# Altium project Competion.PrjPCB
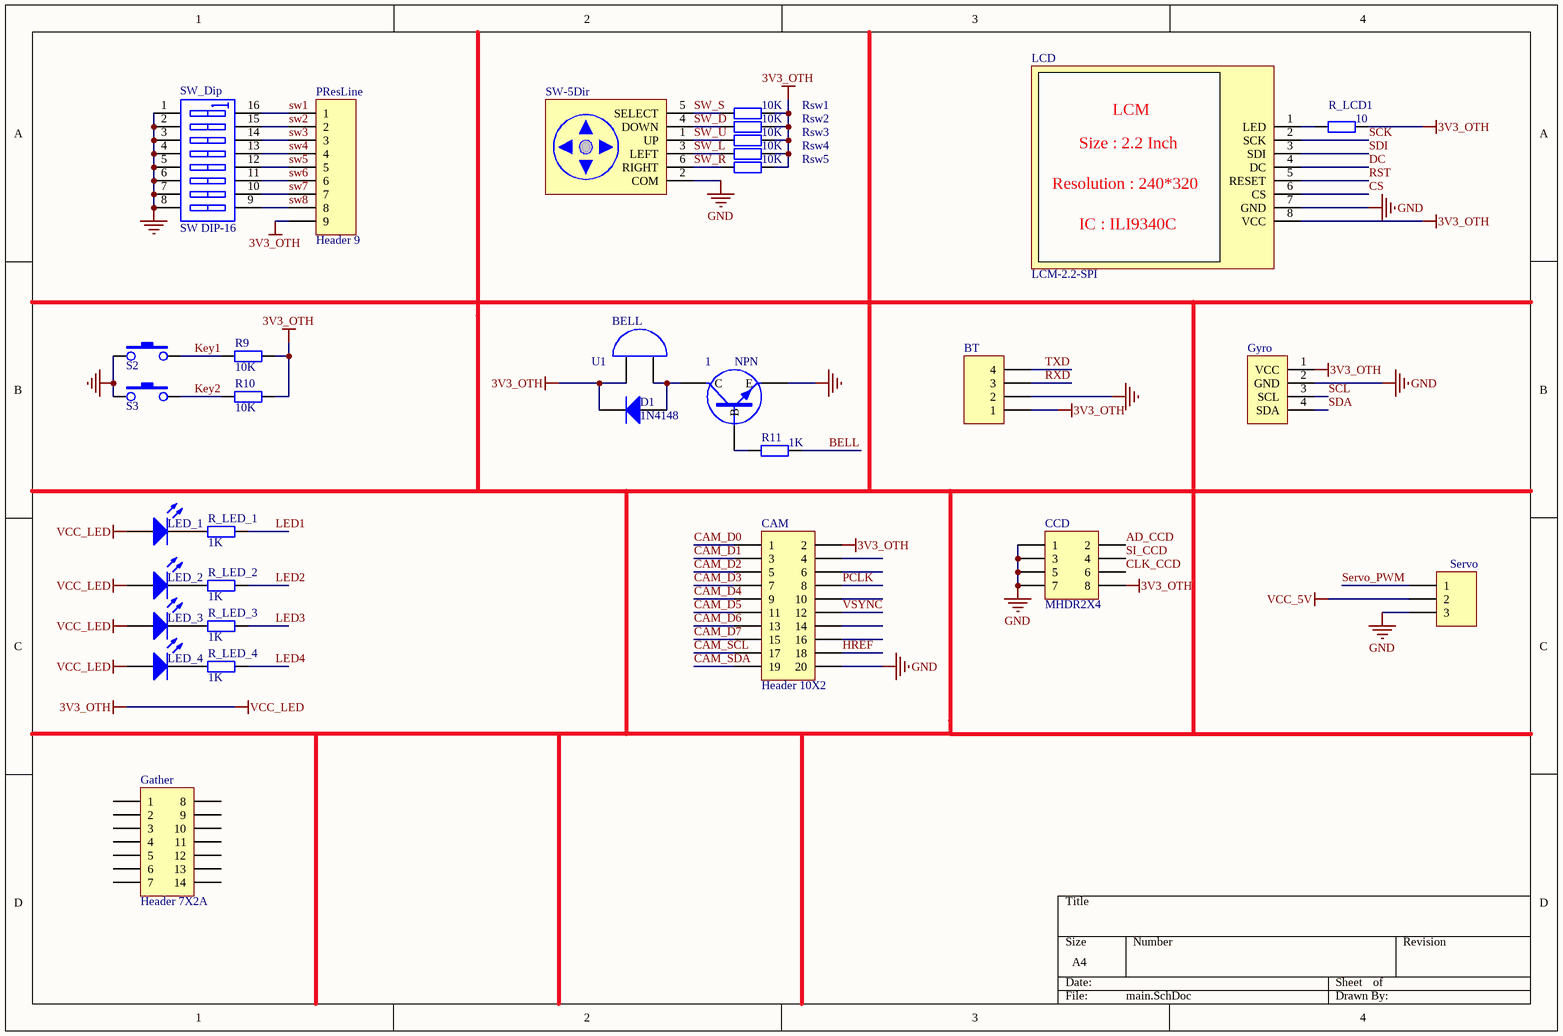
[diagram p0: main.SchDoc]
5 sheets, 81 parts. Net scope: global (net labels, ports and power ports of the same name join across sheets).
Board file: Competion.PcbDoc
Sheets:
  main.SchDoc
  K60_main.SchDoc
  Power.SchDoc
  Sensor.SchDoc
  export.SchDoc

## Sheet main.SchDoc
size A4

### Parts
1  NPN  [BEC_123_S]
BT  Header 4  [HDR1X4]  (value not drawn)
CAM  Header 10X2  [Camer]
CCD  MHDR2X4  [CCD]
D1  1N4148  [1N4148]
Gather  Header 7X2A  [HDR2X7_CEN]
Gyro  Gyro  [GYRO]  (value not drawn)
LCD  LCM-2.2-SPI  [LCD]
LED_1  LED  [0805-S]  (value not drawn)
LED_2  LED  [0805-S]  (value not drawn)
LED_3  LED  [0805-S]  (value not drawn)
LED_4  LED  [0805-S]  (value not drawn)
PResLine  Header 9  [HDR1X9]
R9  10K  [0805-S]
R10  10K  [0805-S]
R11  1K  [0805-S]
R_LCD1  10  [0805-S]
R_LED_1  1K  [0805-S]
R_LED_2  1K  [0805-S]
R_LED_3  1K  [0805-S]
R_LED_4  1K  [0805-S]
Rsw1  10K  [0805-S]
Rsw2  10K  [0805-S]
Rsw3  10K  [0805-S]
Rsw4  10K  [0805-S]
Rsw5  10K  [0805-S]
S2  SW-PB  [key-press]  (value not drawn)
S3  SW-PB  [key-press]  (value not drawn)
Servo  Ser_head  [HDR1X3]  (value not drawn)
SW-5Dir  SW-5dir  [SW-5dir]  (value not drawn)
SW_Dip  SW DIP-16  [DIP16]
U1  BELL  [BEEP]

### Nets
3V3_OTH: BT.1 CAM.2 CCD.8 D1.2(K) Gyro.1(VCC) LCD.8(VCC) LED_1.1(A) LED_2.1(A) LED_3.1(A) LED_4.1(A) PResLine.9 R9.1 R10.1 R_LCD1.1 Rsw1.2 Rsw2.2 Rsw3.2 Rsw4.2 Rsw5.2 U1.1(A)  [also labelled VCC_LED]
GND: 1.2(E) BT.2 CAM.20 CCD.1 CCD.3 CCD.5 CCD.7 Gyro.2(GND) LCD.7(GND) S2.1 S3.1 Servo.3 SW-5Dir.2(COM) SW_Dip.1(A1) SW_Dip.2(A2) SW_Dip.3(A3) SW_Dip.4(A4) SW_Dip.5(A5) SW_Dip.6(A6) SW_Dip.7(A7) SW_Dip.8(A8)
VCC_5V: Servo.2
AD_CCD: CCD.2
BELL: R11.2
CAM_D0: CAM.1
CAM_D1: CAM.3
CAM_D2: CAM.5
CAM_D3: CAM.7
CAM_D4: CAM.9
CAM_D5: CAM.11
CAM_D6: CAM.13
CAM_D7: CAM.15
CAM_SCL: CAM.17
CAM_SDA: CAM.19
CLK_CCD: CCD.6
CS: LCD.6(CS)
DC: LCD.4(DC)
HREF: CAM.18
Key1: R9.2 S2.2
Key2: R10.2 S3.2
LED1: R_LED_1.1
LED2: R_LED_2.1
LED3: R_LED_3.1
LED4: R_LED_4.1
PCLK: CAM.8
RST: LCD.5(RESET)  [project net PE7]
RXD: BT.3  [project net PD6]
SCK: LCD.2(SCK)  [project net PE10]
SCL: Gyro.3(SCL)  [project net PC19]
SDA: Gyro.4(SDA)  [project net PD0]
SDI: LCD.3(SDI)  [project net PE9]
Servo_PWM: Servo.1  [project net PA8]
SI_CCD: CCD.4  [project net PB1]
sw1: PResLine.1 SW_Dip.16(B1)  [project net PC6]
sw2: PResLine.2 SW_Dip.15(B2)  [project net PC7]
sw3: PResLine.3 SW_Dip.14(B3)  [project net PC8]
sw4: PResLine.4 SW_Dip.13(B4)  [project net PC9]
sw5: PResLine.5 SW_Dip.12(B5)  [project net PC10]
sw6: PResLine.6 SW_Dip.11(B6)  [project net PC11]
sw7: PResLine.7 SW_Dip.10(B7)  [project net PC12]
sw8: PResLine.8 SW_Dip.9(B8)  [project net PC13]
SW_D: Rsw2.1 SW-5Dir.4(DOWN)  [project net PB6]
SW_L: Rsw4.1 SW-5Dir.3(LEFT)  [project net PB10]
SW_R: Rsw5.1 SW-5Dir.6(RIGHT)  [project net PB7]
SW_S: Rsw1.1 SW-5Dir.5(SELECT)  [project net PB8]
SW_U: Rsw3.1 SW-5Dir.1(UP)  [project net PB9]
TXD: BT.4  [project net PD7]
VSYNC: CAM.12  [project net PD14]
Net1_1: 1.1(B) R11.1
Net1_3: 1.3(C) D1.1(A) U1.2(B)
NetLCD_1: LCD.1(LED) R_LCD1.2
NetLED_1_2: LED_1.2(K) R_LED_1.2
NetLED_2_2: LED_2.2(K) R_LED_2.2
NetLED_3_2: LED_3.2(K) R_LED_3.2
NetLED_4_2: LED_4.2(K) R_LED_4.2

Not connected (* = marked no-connect by the designer): CAM 4 6 10 14 16; Gather 1 2 3 4 5 6 7 8 9 10 11 12 13 14

### Notes on the sheet
- (in symbol LCM-2.2-SPI) LCM; Size : 2.2 Inch; Resolution : 240*320; IC : ILI9340C

### Library data of the parts
BT = Header 4: Header, 4-Pin; LatestRevisionDate: 17-Jul-2002; LatestRevisionNote: Re-released for DXP Platform.; Publisher: Altium Limited
CAM = Header 10X2: Header, 10-Pin, Dual row; LatestRevisionDate: 17-Jul-2002; LatestRevisionNote: Re-released for DXP Platform.; Publisher: Altium Limited
CCD = MHDR2X4: Header, 4-Pin, Dual row; LatestRevisionDate: 17-Jul-2002; LatestRevisionNote: Re-released for DXP Platform.; Publisher: Altium Limited
D1 = Diode: Published: 8-Jun-2000; LatestRevisionDate: 17-Jul-2002; LatestRevisionNote: Re-released for DXP Platform.; PackageDocument: Sep-1996; Publisher: Altium Limited; Code_JEDEC: DO-214-AB
Gather = Header 7X2A: Header, 7-Pin, Dual row; LatestRevisionDate: 17-Jul-2002; LatestRevisionNote: Re-released for DXP Platform.; Publisher: Altium Limited
LCD = LCM-2.2-SPI: LCM 2.2inch SPI; LatestRevisionDate: 17-Jul-2002; LatestRevisionNote: Re-released for DXP Platform.; Publisher: Altium Limited
LED_1-LED_4 = LED0: Typical INFRARED GaAs LED; Published: 8-Jun-2000; LatestRevisionDate: 08-Jul-2005; LatestRevisionNote: Mech Layer 1 removed.; PackageReference: LED-0; Publisher: Altium Limited
PResLine = Header 9: Header, 9-Pin; LatestRevisionDate: 17-Jul-2002; LatestRevisionNote: Re-released for DXP Platform.; Publisher: Altium Limited
R9 R10 R_LCD1 = Res2: Resistor; Value: 3.32K; Published: 8-Jun-2000; LatestRevisionDate: 17-Jul-2002; LatestRevisionNote: Re-released for DXP Platform.; PackageReference: AXIAL-0.4; Publisher: Altium Limited; PackageDescription: Axial Device, Thru-Hole; 2 Leads; 0.4 in Pin Spacing
R11 R_LED_1-R_LED_4 = Res2: Resistor; Published: 8-Jun-2000; LatestRevisionDate: 17-Jul-2002; LatestRevisionNote: Re-released for DXP Platform.; PackageReference: AXIAL-0.4; Publisher: Altium Limited; Value: 1K
Rsw1-Rsw5 = Res2: Resistor; Value: 1K; Published: 8-Jun-2000; LatestRevisionDate: 17-Jul-2002; LatestRevisionNote: Re-released for DXP Platform.; PackageReference: AXIAL-0.4; Publisher: Altium Limited
Servo = Header 3: Header, 3-Pin; LatestRevisionDate: 17-Jul-2002; LatestRevisionNote: Re-released for DXP Platform.; Publisher: Altium Limited
SW-5Dir = SW-5dir: 2pin_GND; LatestRevisionDate: 17-Jul-2002; LatestRevisionNote: Re-released for DXP Platform.; Publisher: Altium Limited
SW_Dip = SW DIP-8: DIP Switch, 8 Position, SPST; Published: 24-Mar-1999; LatestRevisionDate: 17-Jul-2002; LatestRevisionNote: Re-released for DXP Platform.; PackageReference: DIP_SW_8WAY_SMD; Publisher: Altium Limited

## Sheet K60_main.SchDoc
size A4
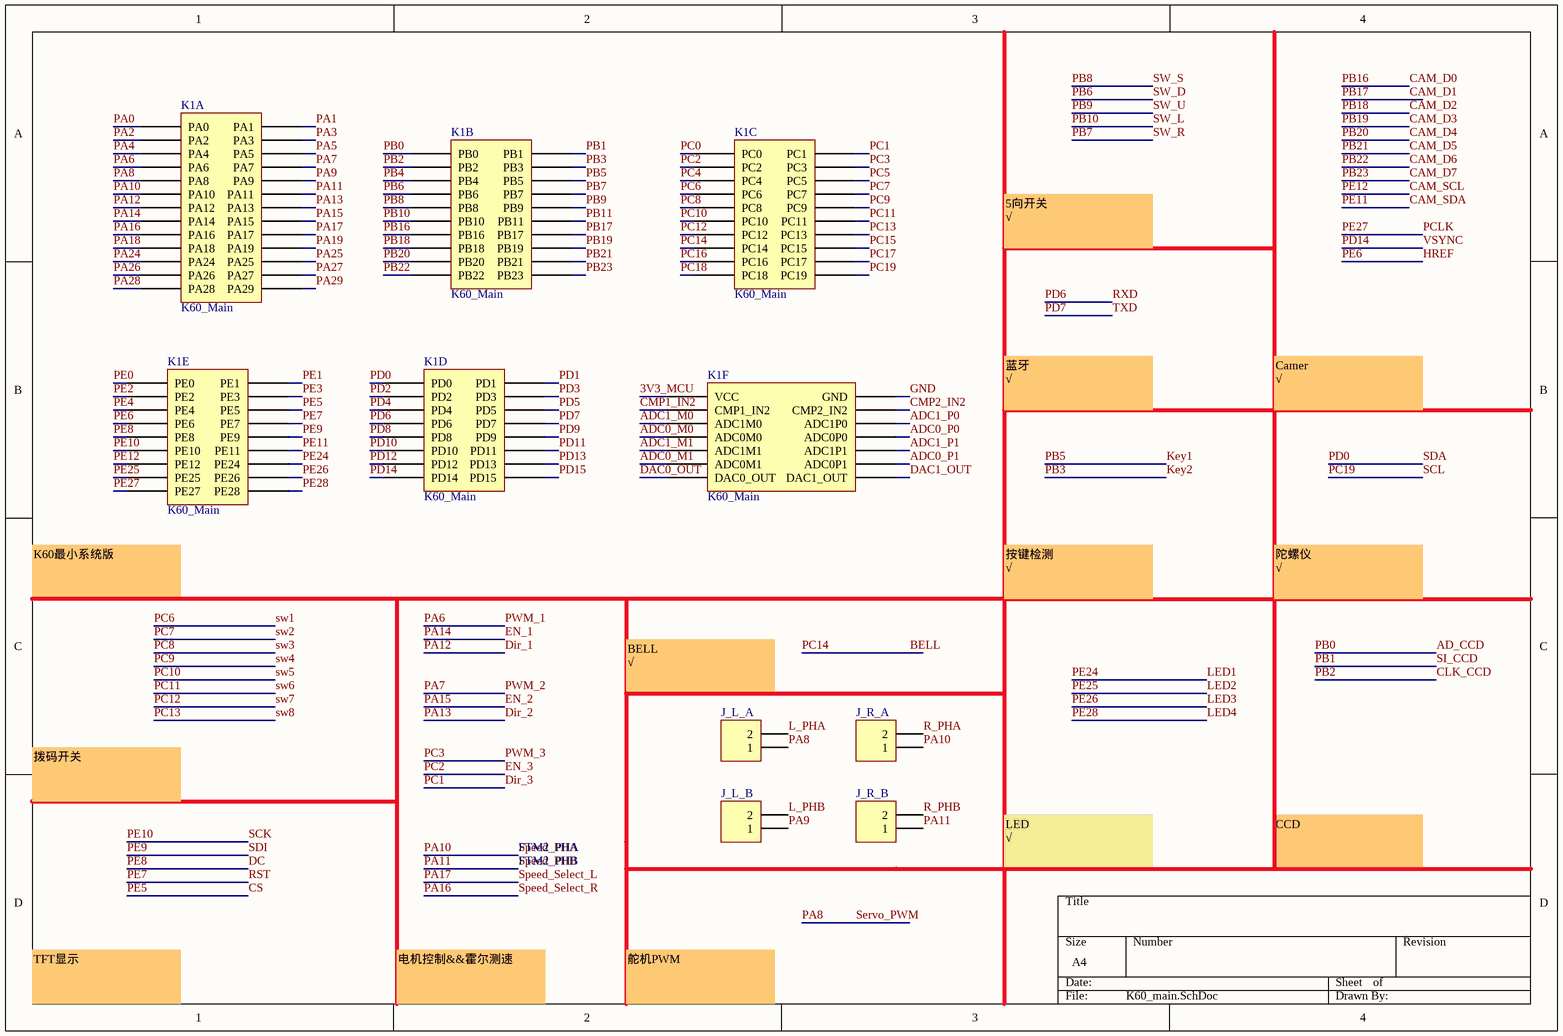
[diagram p1: K60_main.SchDoc]

### Parts
J_L_A  Header 2  [HDR1X2]  (value not drawn)
J_L_B  Header 2  [HDR1X2]  (value not drawn)
J_R_A  Header 2  [HDR1X2]  (value not drawn)
J_R_B  Header 2  [HDR1X2]  (value not drawn)
K1  K60_Main  [K60_Main_Board]  (parts A,B,C,D,E,F of 6)

### Nets
3V3_MCU: K1.11(VCC)
GND: K1.12(GND)
AD_CCD: K1.49(PB0)  [also labelled PB0]
ADC0_M0: K1.23(ADC0M0)
ADC0_M1: K1.27(ADC0M1)
ADC0_P0: K1.24(ADC0P0)
ADC0_P1: K1.28(ADC0P1)
ADC1_M0: K1.21(ADC1M0)
ADC1_M1: K1.25(ADC1M1)
ADC1_P0: K1.22(ADC1P0)
ADC1_P1: K1.26(ADC1P1)
BELL: K1.35(PC14)  [also labelled PC14]
CAM_D0: K1.327(PB16)  [also labelled PB16]
CAM_D1: K1.326(PB17)  [also labelled PB17]
CAM_D2: K1.325(PB18)  [also labelled PB18]
CAM_D3: K1.324(PB19)  [also labelled PB19]
CAM_D4: K1.323(PB20)  [also labelled PB20]
CAM_D5: K1.322(PB21)  [also labelled PB21]
CAM_D6: K1.321(PB22)  [also labelled PB22]
CAM_D7: K1.320(PB23)  [also labelled PB23]
CAM_SCL: K1.29(PE12)  [also labelled PE12]
CAM_SDA: K1.210(PE11)  [also labelled PE11]
CLK_CCD: K1.47(PB2)  [also labelled PB2]
CMP1_IN2: K1.13(CMP1_IN2)
CMP2_IN2: K1.14(CMP2_IN2)
CS: K1.216(PE5)  [also labelled PE5]
DAC0_OUT: K1.54(DAC0_OUT)
DAC1_OUT: K1.53(DAC1_OUT)
DC: K1.213(PE8)  [also labelled PE8]
Dir_1: K1.423(PA12)  [also labelled PA12]
Dir_2: K1.422(PA13)  [also labelled PA13]
Dir_3: K1.318(PC1)  [also labelled PC1]
EN_1: K1.421(PA14)  [also labelled PA14]
EN_2: K1.420(PA15)  [also labelled PA15]
EN_3: K1.317(PC2)  [also labelled PC2]
HREF: K1.215(PE6)  [also labelled PE6]
Key1: K1.44(PB5)  [also labelled PB5]
Key2: K1.46(PB3)  [also labelled PB3]
L_PHA: J_L_A.2
L_PHB: J_L_B.2
LED1: K1.52(PE24)  [also labelled PE24]
LED2: K1.51(PE25)  [also labelled PE25]
LED3: K1.438(PE26)  [also labelled PE26]
LED4: K1.436(PE28)  [also labelled PE28]
PA0: K1.435(PA0)
PA1: K1.434(PA1)
PA2: K1.433(PA2)
PA3: K1.432(PA3)
PA4: K1.431(PA4)
PA5: K1.430(PA5)
PA6: K1.429(PA6)  [also labelled PWM_1]
PA7: K1.428(PA7)  [also labelled PWM_2]
PA8: J_L_A.1 K1.427(PA8)  [also labelled Servo_PWM]
PA9: J_L_B.1 K1.426(PA9)
PA10: J_R_A.1 K1.425(PA10)  [also labelled Speed_PHA]
PA11: J_R_B.1 K1.424(PA11)  [also labelled Speed_PHB]
PA16: K1.419(PA16)  [also labelled Speed_Select_R]
PA17: K1.418(PA17)  [also labelled Speed_Select_L]
PA18: K1.417(PA18)
PA19: K1.416(PA19)
PA24: K1.415(PA24)
PA25: K1.414(PA25)
PA26: K1.413(PA26)
PA27: K1.412(PA27)
PA28: K1.411(PA28)
PA29: K1.410(PA29)
PB1: K1.48(PB1)  [also labelled SI_CCD]
PB4: K1.45(PB4)
PB6: K1.43(PB6)  [also labelled SW_D]
PB7: K1.42(PB7)  [also labelled SW_R]
PB8: K1.41(PB8)  [also labelled SW_S]
PB9: K1.330(PB9)  [also labelled SW_U]
PB10: K1.329(PB10)  [also labelled SW_L]
PB11: K1.328(PB11)
PC0: K1.319(PC0)
PC3: K1.316(PC3)  [also labelled PWM_3]
PC4: K1.315(PC4)
PC5: K1.314(PC5)
PC6: K1.313(PC6)  [also labelled sw1]
PC7: K1.312(PC7)  [also labelled sw2]
PC8: K1.311(PC8)  [also labelled sw3]
PC9: K1.310(PC9)  [also labelled sw4]
PC10: K1.39(PC10)  [also labelled sw5]
PC11: K1.38(PC11)  [also labelled sw6]
PC12: K1.37(PC12)  [also labelled sw7]
PC13: K1.36(PC13)  [also labelled sw8]
PC15: K1.34(PC15)
PC16: K1.33(PC16)
PC17: K1.32(PC17)
PC18: K1.31(PC18)
PC19: K1.238(PC19)  [also labelled SCL]
PCLK: K1.437(PE27)  [also labelled PE27]
PD0: K1.237(PD0)  [also labelled SDA]
PD1: K1.236(PD1)
PD2: K1.235(PD2)
PD3: K1.234(PD3)
PD4: K1.233(PD4)
PD5: K1.232(PD5)
PD6: K1.231(PD6)  [also labelled RXD]
PD7: K1.230(PD7)  [also labelled TXD]
PD8: K1.229(PD8)
PD9: K1.228(PD9)
PD10: K1.227(PD10)
PD11: K1.226(PD11)
PD12: K1.225(PD12)
PD13: K1.224(PD13)
PD14: K1.223(PD14)  [also labelled VSYNC]
PD15: K1.222(PD15)
PE0: K1.221(PE0)
PE1: K1.220(PE1)
PE2: K1.219(PE2)
PE3: K1.218(PE3)
PE4: K1.217(PE4)
PE7: K1.214(PE7)  [also labelled RST]
PE9: K1.212(PE9)  [also labelled SDI]
PE10: K1.211(PE10)  [also labelled SCK]
R_PHA: J_R_A.2
R_PHB: J_R_B.2

### Notes on the sheet
- 5向开关
  √
- 蓝牙
  √
- Camer
  √
- K60最小系统版
- 按键检测
  √
- 陀螺仪
  √
- (near J_L_A) BELL
  √
- 拨码开关
- FTM2_PHA
- FTM2_PHB
- LED
  √
- CCD
- TFT显示
- 电机控制&&霍尔测速
- 舵机PWM

### Library data of the parts
J_L_A J_L_B J_R_A J_R_B = Header 2: Header, 2-Pin; LatestRevisionDate: 17-Jul-2002; LatestRevisionNote: Re-released for DXP Platform.; Publisher: Altium Limited

## Sheet Power.SchDoc
size A4
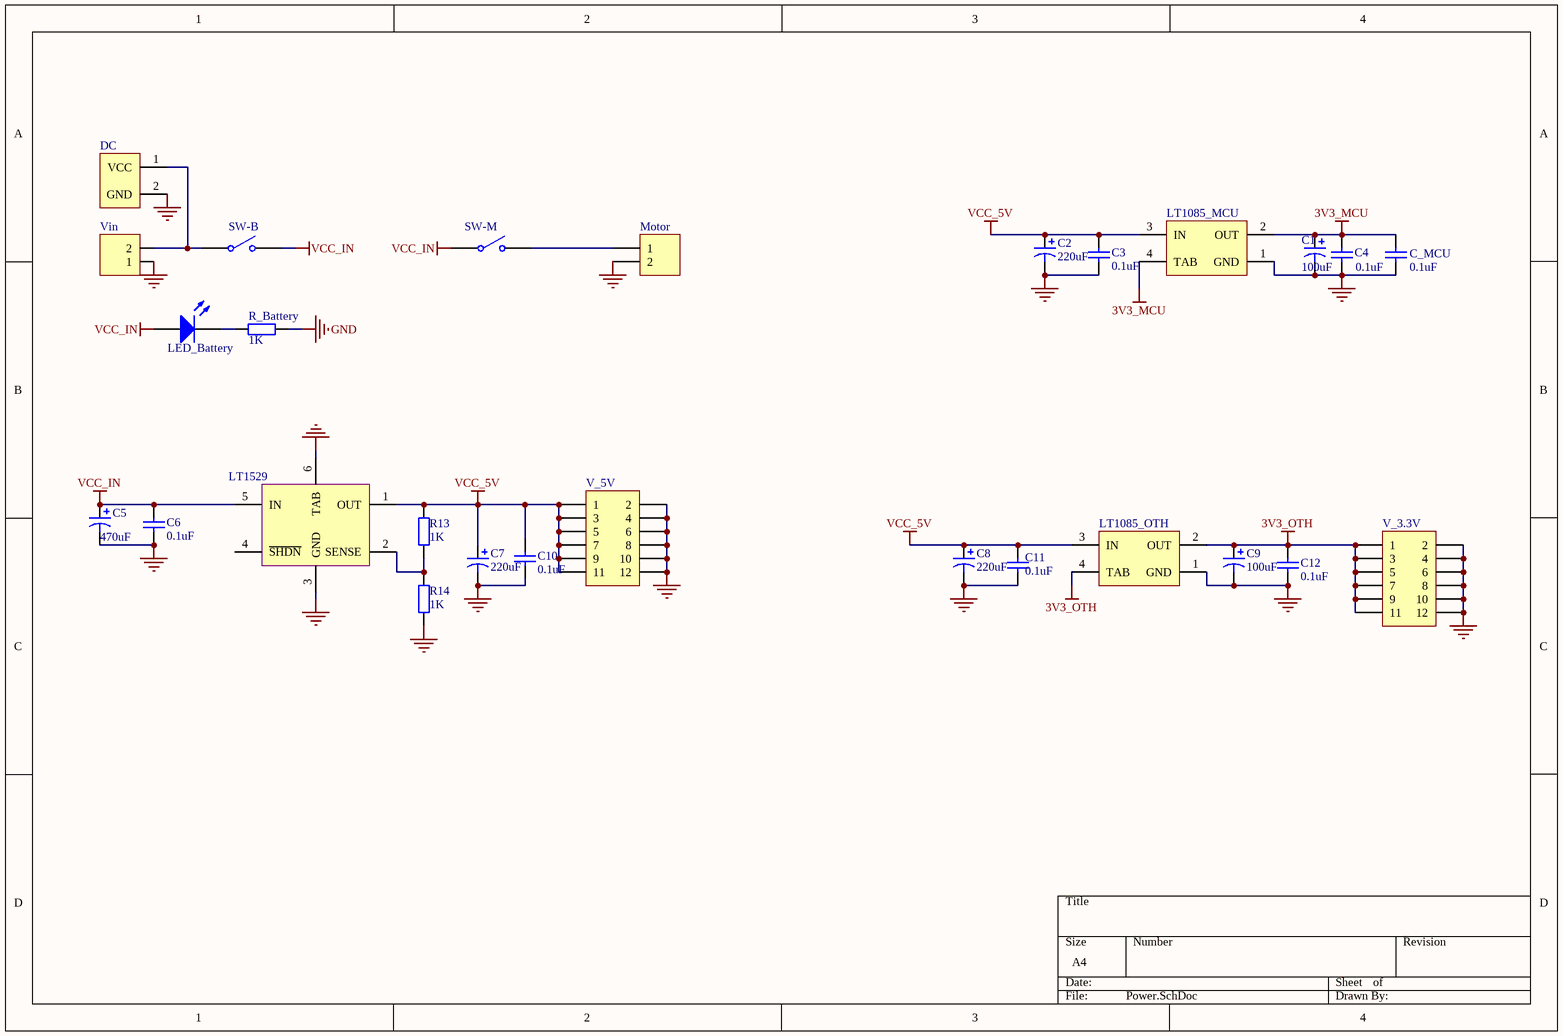
[diagram p2: Power.SchDoc]

### Parts
C1  100uf  [100uf-25V]
C2  220uf  [220UF-25V]
C3  0.1uf  [0805-S]
C4  0.1uf  [0805-S]
C5  470uf  [220UF-25V]
C6  0.1uF  [0805-S]
C7  220uf  [220UF-25V]
C8  220uf  [220UF-25V]
C9  100uf  [100uf-25V]
C10  0.1uF  [0805-S]
C11  0.1uf  [0805-S]
C12  0.1uf  [0805-S]
C_MCU  0.1uf  [0805-S]
DC  DC0005  [DC]  (value not drawn)
LED_Battery  LED  [0805-S]  (value not drawn)
LT1085_MCU  LT1085-3.3  [TS3B_N]  (value not drawn)
LT1085_OTH  LT1085-3.3  [TS3B_N]  (value not drawn)
LT1529  LT1529  [TS5B]  (value not drawn)
Motor  Header 2  [Head2_small]  (value not drawn)
R13  1K  [0805-S]
R14  1K  [0805-S]
R_Battery  1K  [0805-S]
SW-B  SW-TOGGLE  [SW-TOGGLE]  (value not drawn)
SW-M  SW-TOGGLE  [SW-TOGGLE]  (value not drawn)
V_3.3V  Header 6X2  [HDR2X6]  (value not drawn)
V_5V  Header 6X2  [HDR2X6]  (value not drawn)
Vin  Header 2  [Head2_small]  (value not drawn)

### Nets
3V3_MCU: C1.1 C4.2 C_MCU.2 LT1085_MCU.2(OUT) LT1085_MCU.4(TAB)
3V3_OTH: C9.1 C12.2 LT1085_OTH.2(OUT) LT1085_OTH.4(TAB) V_3.3V.1 V_3.3V.3 V_3.3V.5 V_3.3V.7 V_3.3V.9 V_3.3V.11
GND: C1.2 C2.2 C3.1 C4.1 C5.2 C6.1 C7.2 C8.2 C9.2 C10.1 C11.1 C12.1 C_MCU.1 DC.2(GND) LT1085_MCU.1(GND) LT1085_OTH.1(GND) LT1529.3(GND) LT1529.6(TAB) Motor.2 R14.1 R_Battery.1 V_3.3V.2 V_3.3V.4 V_3.3V.6 V_3.3V.8 V_3.3V.10 V_3.3V.12 V_5V.2 V_5V.4 V_5V.6 V_5V.8 V_5V.10 V_5V.12 Vin.1
VCC_5V: C2.1 C3.2 C7.1 C8.1 C10.2 C11.2 LT1085_MCU.3(IN) LT1085_OTH.3(IN) LT1529.1(OUT) R13.2 V_5V.1 V_5V.3 V_5V.5 V_5V.7 V_5V.9 V_5V.11
VCC_IN: C5.1 C6.2 LED_Battery.1(A) LT1529.5(IN) SW-B.2(NO) SW-M.1(COMMON)
NetDC_1: DC.1(VCC) SW-B.1(COMMON) Vin.2
NetLED_Battery_2: LED_Battery.2(K) R_Battery.2
NetLT1529_2: LT1529.2(SENSE) R13.1 R14.2
NetMotor_1: Motor.1 SW-M.2(NO)

Not connected (* = marked no-connect by the designer): LT1529 4(~{SHDN})

### Library data of the parts
C1 C2 C5 C7-C9 = Cap Pol1: Polarized Capacitor (Radial); Published: 8-Jun-2000; LatestRevisionDate: 17-Jul-2002; LatestRevisionNote: Re-released for DXP Platform.; PackageReference: RB7.6-15; Publisher: Altium Limited; PackageDescription: Polarized Capacitor (Radial); 2 Leads
  C1 C9: Value: 100uF
  C2 C7 C8: Value: 220uF
  C5: Value: 470uF
C3 C4 C11 C12 C_MCU = Cap: Capacitor; Published: 8-Jun-2000; LatestRevisionDate: 17-Jul-2002; LatestRevisionNote: Re-released for DXP Platform.; PackageReference: RAD-0.3; Publisher: Altium Limited; PackageDescription: Radial Cap, Thru-Hole; 2 Leads; 0.3 in Pin Spacing; Value: 0.1uF
C6 C10 = Cap_1: Capacitor; Published: 8-Jun-2000; LatestRevisionDate: 17-Jul-2002; LatestRevisionNote: Re-released for DXP Platform.; PackageReference: RAD-0.3; Publisher: Altium Limited; Value: 0.1uF
LED_Battery = LED0: Typical INFRARED GaAs LED; Published: 8-Jun-2000; LatestRevisionDate: 08-Jul-2005; LatestRevisionNote: Mech Layer 1 removed.; PackageReference: LED-0; Publisher: Altium Limited
Motor Vin = Header 2: Header, 2-Pin; LatestRevisionDate: 17-Jul-2002; LatestRevisionNote: Re-released for DXP Platform.; Publisher: Altium Limited
R13 R14 = Res2_3: Resistor; Published: 8-Jun-2000; LatestRevisionDate: 17-Jul-2002; LatestRevisionNote: Re-released for DXP Platform.; PackageReference: AXIAL-0.4; Publisher: Altium Limited; Value: 1K
R_Battery = Res2: Resistor; Published: 8-Jun-2000; LatestRevisionDate: 17-Jul-2002; LatestRevisionNote: Re-released for DXP Platform.; PackageReference: AXIAL-0.4; Publisher: Altium Limited; Value: 1K
SW-B SW-M = SW-TOGGLE: Single-Pole, Single-Throw Switch; Published: 24-Mar-1999; LatestRevisionDate: 17-Jul-2002; LatestRevisionNote: Re-released for DXP Platform.; PackageReference: SPST-2; Publisher: Altium Limited
V_3.3V V_5V = Header 6X2: Header, 6-Pin, Dual row; LatestRevisionDate: 17-Jul-2002; LatestRevisionNote: Re-released for DXP Platform.; Publisher: Altium Limited

## Sheet Sensor.SchDoc
size A4
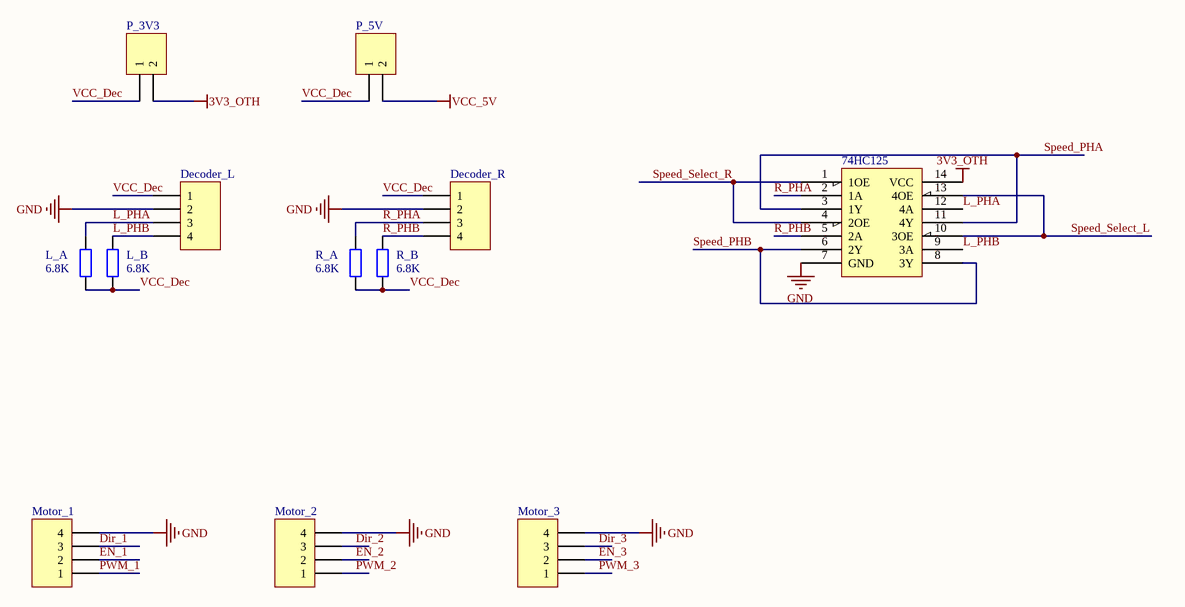
[diagram p3: Sensor.SchDoc]

### Parts
74HC125  74HC125  [751A-02_N]  (value not drawn)
Decoder_L  Header 4  [HDR1X4]  (value not drawn)
Decoder_R  Header 4  [HDR1X4]  (value not drawn)
L_A  6.8K  [0805-S]
L_B  6.8K  [0805-S]
Motor_1  Header 4  [HDR1X4]  (value not drawn)
Motor_2  Header 4  [HDR1X4]  (value not drawn)
Motor_3  Header 4  [HDR1X4]  (value not drawn)
P_3V3  Header 2  [HDR1X2]  (value not drawn)
P_5V  Header 2  [HDR1X2]  (value not drawn)
R_A  6.8K  [0805-S]
R_B  6.8K  [0805-S]

### Nets
3V3_OTH: 74HC125.14(VCC) P_3V3.2
GND: 74HC125.7(GND) Decoder_L.2 Decoder_R.2 Motor_1.4 Motor_2.4 Motor_3.4
VCC_5V: P_5V.2
Dir_1: Motor_1.3
Dir_2: Motor_2.3
Dir_3: Motor_3.3
EN_1: Motor_1.2
EN_2: Motor_2.2
EN_3: Motor_3.2
L_PHA: 74HC125.12(4A) Decoder_L.3 L_A.2
L_PHB: 74HC125.9(3A) Decoder_L.4 L_B.2
PWM_1: Motor_1.1  [project net PA6]
PWM_2: Motor_2.1  [project net PA7]
PWM_3: Motor_3.1  [project net PC3]
R_PHA: 74HC125.2(1A) Decoder_R.3 R_A.2
R_PHB: 74HC125.5(2A) Decoder_R.4 R_B.2
Speed_PHA: 74HC125.3(1Y) 74HC125.11(4Y)  [project net PA10]
Speed_PHB: 74HC125.6(2Y) 74HC125.8(3Y)  [project net PA11]
Speed_Select_L: 74HC125.10(3OE) 74HC125.13(4OE)  [project net PA17]
Speed_Select_R: 74HC125.1(1OE) 74HC125.4(2OE)  [project net PA16]
VCC_Dec: Decoder_L.1 Decoder_R.1 L_A.1 L_B.1 P_3V3.1 P_5V.1 R_A.1 R_B.1

### Library data of the parts
Decoder_L Decoder_R Motor_1-Motor_3 = Header 4: Header, 4-Pin; LatestRevisionDate: 17-Jul-2002; LatestRevisionNote: Re-released for DXP Platform.; Publisher: Altium Limited
L_A L_B R_A R_B = Res2_3: Resistor; Published: 8-Jun-2000; LatestRevisionDate: 17-Jul-2002; LatestRevisionNote: Re-released for DXP Platform.; PackageReference: AXIAL-0.4; Publisher: Altium Limited; Value: 6.8K
P_3V3 P_5V = Header 2: Header, 2-Pin; LatestRevisionDate: 17-Jul-2002; LatestRevisionNote: Re-released for DXP Platform.; Publisher: Altium Limited

## Sheet export.SchDoc
size A4
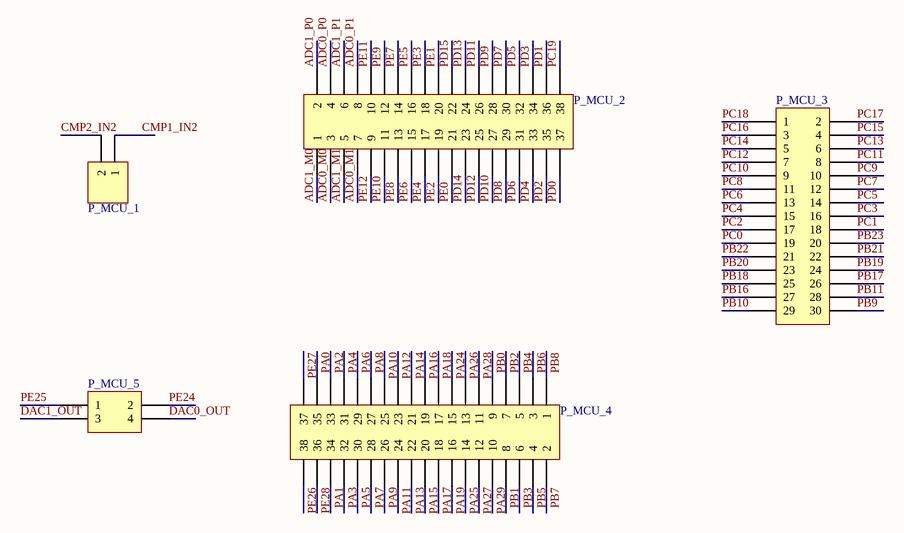
[diagram p4: export.SchDoc]

### Parts
P_MCU_1  Header 2  [HDR1X2]  (value not drawn)
P_MCU_2  Header 19X2  [HDR2X19]  (value not drawn)
P_MCU_3  Header 15X2  [HDR2X15]  (value not drawn)
P_MCU_4  Header 19X2  [HDR2X19]  (value not drawn)
P_MCU_5  Header 2X2  [HDR2X2]  (value not drawn)

### Nets
ADC0_M0: P_MCU_2.3
ADC0_M1: P_MCU_2.7
ADC0_P0: P_MCU_2.4
ADC0_P1: P_MCU_2.8
ADC1_M0: P_MCU_2.1
ADC1_M1: P_MCU_2.5
ADC1_P0: P_MCU_2.2
ADC1_P1: P_MCU_2.6
CMP1_IN2: P_MCU_1.1
CMP2_IN2: P_MCU_1.2
DAC0_OUT: P_MCU_5.4
DAC1_OUT: P_MCU_5.3
PA0: P_MCU_4.35
PA1: P_MCU_4.34
PA2: P_MCU_4.33
PA3: P_MCU_4.32
PA4: P_MCU_4.31
PA5: P_MCU_4.30
PA6: P_MCU_4.29
PA7: P_MCU_4.28
PA8: P_MCU_4.27
PA9: P_MCU_4.26
PA10: P_MCU_4.25
PA11: P_MCU_4.24
PA12: P_MCU_4.23  [project net Dir_1]
PA13: P_MCU_4.22  [project net Dir_2]
PA14: P_MCU_4.21  [project net EN_1]
PA15: P_MCU_4.20  [project net EN_2]
PA16: P_MCU_4.19
PA17: P_MCU_4.18
PA18: P_MCU_4.17
PA19: P_MCU_4.16
PA24: P_MCU_4.15
PA25: P_MCU_4.14
PA26: P_MCU_4.13
PA27: P_MCU_4.12
PA28: P_MCU_4.11
PA29: P_MCU_4.10
PB0: P_MCU_4.9  [project net AD_CCD]
PB1: P_MCU_4.8
PB2: P_MCU_4.7  [project net CLK_CCD]
PB3: P_MCU_4.6  [project net Key2]
PB4: P_MCU_4.5
PB5: P_MCU_4.4  [project net Key1]
PB6: P_MCU_4.3
PB7: P_MCU_4.2
PB8: P_MCU_4.1
PB9: P_MCU_3.30
PB10: P_MCU_3.29
PB11: P_MCU_3.28
PB16: P_MCU_3.27  [project net CAM_D0]
PB17: P_MCU_3.26  [project net CAM_D1]
PB18: P_MCU_3.25  [project net CAM_D2]
PB19: P_MCU_3.24  [project net CAM_D3]
PB20: P_MCU_3.23  [project net CAM_D4]
PB21: P_MCU_3.22  [project net CAM_D5]
PB22: P_MCU_3.21  [project net CAM_D6]
PB23: P_MCU_3.20  [project net CAM_D7]
PC0: P_MCU_3.19
PC1: P_MCU_3.18  [project net Dir_3]
PC2: P_MCU_3.17  [project net EN_3]
PC3: P_MCU_3.16
PC4: P_MCU_3.15
PC5: P_MCU_3.14
PC6: P_MCU_3.13
PC7: P_MCU_3.12
PC8: P_MCU_3.11
PC9: P_MCU_3.10
PC10: P_MCU_3.9
PC11: P_MCU_3.8
PC12: P_MCU_3.7
PC13: P_MCU_3.6
PC14: P_MCU_3.5  [project net BELL]
PC15: P_MCU_3.4
PC16: P_MCU_3.3
PC17: P_MCU_3.2
PC18: P_MCU_3.1
PC19: P_MCU_2.38
PD0: P_MCU_2.37
PD1: P_MCU_2.36
PD2: P_MCU_2.35
PD3: P_MCU_2.34
PD4: P_MCU_2.33
PD5: P_MCU_2.32
PD6: P_MCU_2.31
PD7: P_MCU_2.30
PD8: P_MCU_2.29
PD9: P_MCU_2.28
PD10: P_MCU_2.27
PD11: P_MCU_2.26
PD12: P_MCU_2.25
PD13: P_MCU_2.24
PD14: P_MCU_2.23
PD15: P_MCU_2.22
PE0: P_MCU_2.21
PE1: P_MCU_2.20
PE2: P_MCU_2.19
PE3: P_MCU_2.18
PE4: P_MCU_2.17
PE5: P_MCU_2.16  [project net CS]
PE6: P_MCU_2.15  [project net HREF]
PE7: P_MCU_2.14
PE8: P_MCU_2.13  [project net DC]
PE9: P_MCU_2.12
PE10: P_MCU_2.11
PE11: P_MCU_2.10  [project net CAM_SDA]
PE12: P_MCU_2.9  [project net CAM_SCL]
PE24: P_MCU_5.2  [project net LED1]
PE25: P_MCU_5.1  [project net LED2]
PE26: P_MCU_4.38  [project net LED3]
PE27: P_MCU_4.37  [project net PCLK]
PE28: P_MCU_4.36  [project net LED4]

### Library data of the parts
P_MCU_1 = Header 2: Header, 2-Pin; LatestRevisionDate: 17-Jul-2002; LatestRevisionNote: Re-released for DXP Platform.; Publisher: Altium Limited
P_MCU_2 P_MCU_4 = Header 19X2: Header, 19-Pin, Dual row; LatestRevisionDate: 17-Jul-2002; LatestRevisionNote: Re-released for DXP Platform.; Publisher: Altium Limited
P_MCU_3 = Header 15X2: Header, 15-Pin, Dual row; LatestRevisionDate: 17-Jul-2002; LatestRevisionNote: Re-released for DXP Platform.; Publisher: Altium Limited
P_MCU_5 = Header 2X2: Header, 2-Pin, Dual row; LatestRevisionDate: 17-Jul-2002; LatestRevisionNote: Re-released for DXP Platform.; Publisher: Altium Limited

## Nets that join several sheets
3V3_MCU: K60_main (K1.11), Power (5 pins)
3V3_OTH: main (20 pins), Power (10 pins), Sensor (74HC125.14 P_3V3.2)
GND: main (21 pins), K60_main (K1.12), Power (34 pins), Sensor (6 pins)
VCC_5V: main (Servo.2), Power (16 pins), Sensor (P_5V.2)
AD_CCD: main (CCD.2), K60_main (K1.49), export (P_MCU_4.9)
ADC0_M0: K60_main (K1.23), export (P_MCU_2.3)
ADC0_M1: K60_main (K1.27), export (P_MCU_2.7)
ADC0_P0: K60_main (K1.24), export (P_MCU_2.4)
ADC0_P1: K60_main (K1.28), export (P_MCU_2.8)
ADC1_M0: K60_main (K1.21), export (P_MCU_2.1)
ADC1_M1: K60_main (K1.25), export (P_MCU_2.5)
ADC1_P0: K60_main (K1.22), export (P_MCU_2.2)
ADC1_P1: K60_main (K1.26), export (P_MCU_2.6)
BELL: main (R11.2), K60_main (K1.35), export (P_MCU_3.5)
CAM_D0: main (CAM.1), K60_main (K1.327), export (P_MCU_3.27)
CAM_D1: main (CAM.3), K60_main (K1.326), export (P_MCU_3.26)
CAM_D2: main (CAM.5), K60_main (K1.325), export (P_MCU_3.25)
CAM_D3: main (CAM.7), K60_main (K1.324), export (P_MCU_3.24)
CAM_D4: main (CAM.9), K60_main (K1.323), export (P_MCU_3.23)
CAM_D5: main (CAM.11), K60_main (K1.322), export (P_MCU_3.22)
CAM_D6: main (CAM.13), K60_main (K1.321), export (P_MCU_3.21)
CAM_D7: main (CAM.15), K60_main (K1.320), export (P_MCU_3.20)
CAM_SCL: main (CAM.17), K60_main (K1.29), export (P_MCU_2.9)
CAM_SDA: main (CAM.19), K60_main (K1.210), export (P_MCU_2.10)
CLK_CCD: main (CCD.6), K60_main (K1.47), export (P_MCU_4.7)
CMP1_IN2: K60_main (K1.13), export (P_MCU_1.1)
CMP2_IN2: K60_main (K1.14), export (P_MCU_1.2)
CS: main (LCD.6), K60_main (K1.216), export (P_MCU_2.16)
DAC0_OUT: K60_main (K1.54), export (P_MCU_5.4)
DAC1_OUT: K60_main (K1.53), export (P_MCU_5.3)
DC: main (LCD.4), K60_main (K1.213), export (P_MCU_2.13)
Dir_1: K60_main (K1.423), Sensor (Motor_1.3), export (P_MCU_4.23)
Dir_2: K60_main (K1.422), Sensor (Motor_2.3), export (P_MCU_4.22)
Dir_3: K60_main (K1.318), Sensor (Motor_3.3), export (P_MCU_3.18)
EN_1: K60_main (K1.421), Sensor (Motor_1.2), export (P_MCU_4.21)
EN_2: K60_main (K1.420), Sensor (Motor_2.2), export (P_MCU_4.20)
EN_3: K60_main (K1.317), Sensor (Motor_3.2), export (P_MCU_3.17)
HREF: main (CAM.18), K60_main (K1.215), export (P_MCU_2.15)
Key1: main (R9.2 S2.2), K60_main (K1.44), export (P_MCU_4.4)
Key2: main (R10.2 S3.2), K60_main (K1.46), export (P_MCU_4.6)
L_PHA: K60_main (J_L_A.2), Sensor (74HC125.12 Decoder_L.3 L_A.2)
L_PHB: K60_main (J_L_B.2), Sensor (74HC125.9 Decoder_L.4 L_B.2)
LED1: main (R_LED_1.1), K60_main (K1.52), export (P_MCU_5.2)
LED2: main (R_LED_2.1), K60_main (K1.51), export (P_MCU_5.1)
LED3: main (R_LED_3.1), K60_main (K1.438), export (P_MCU_4.38)
LED4: main (R_LED_4.1), K60_main (K1.436), export (P_MCU_4.36)
PA0: K60_main (K1.435), export (P_MCU_4.35)
PA1: K60_main (K1.434), export (P_MCU_4.34)
PA2: K60_main (K1.433), export (P_MCU_4.33)
PA3: K60_main (K1.432), export (P_MCU_4.32)
PA4: K60_main (K1.431), export (P_MCU_4.31)
PA5: K60_main (K1.430), export (P_MCU_4.30)
PA6: K60_main (K1.429), Sensor (Motor_1.1), export (P_MCU_4.29)
PA7: K60_main (K1.428), Sensor (Motor_2.1), export (P_MCU_4.28)
PA8: main (Servo.1), K60_main (J_L_A.1 K1.427), export (P_MCU_4.27)
PA9: K60_main (J_L_B.1 K1.426), export (P_MCU_4.26)
PA10: K60_main (J_R_A.1 K1.425), Sensor (74HC125.3 74HC125.11), export (P_MCU_4.25)
PA11: K60_main (J_R_B.1 K1.424), Sensor (74HC125.6 74HC125.8), export (P_MCU_4.24)
PA16: K60_main (K1.419), Sensor (74HC125.1 74HC125.4), export (P_MCU_4.19)
PA17: K60_main (K1.418), Sensor (74HC125.10 74HC125.13), export (P_MCU_4.18)
PA18: K60_main (K1.417), export (P_MCU_4.17)
PA19: K60_main (K1.416), export (P_MCU_4.16)
PA24: K60_main (K1.415), export (P_MCU_4.15)
PA25: K60_main (K1.414), export (P_MCU_4.14)
PA26: K60_main (K1.413), export (P_MCU_4.13)
PA27: K60_main (K1.412), export (P_MCU_4.12)
PA28: K60_main (K1.411), export (P_MCU_4.11)
PA29: K60_main (K1.410), export (P_MCU_4.10)
PB1: main (CCD.4), K60_main (K1.48), export (P_MCU_4.8)
PB4: K60_main (K1.45), export (P_MCU_4.5)
PB6: main (Rsw2.1 SW-5Dir.4), K60_main (K1.43), export (P_MCU_4.3)
PB7: main (Rsw5.1 SW-5Dir.6), K60_main (K1.42), export (P_MCU_4.2)
PB8: main (Rsw1.1 SW-5Dir.5), K60_main (K1.41), export (P_MCU_4.1)
PB9: main (Rsw3.1 SW-5Dir.1), K60_main (K1.330), export (P_MCU_3.30)
PB10: main (Rsw4.1 SW-5Dir.3), K60_main (K1.329), export (P_MCU_3.29)
PB11: K60_main (K1.328), export (P_MCU_3.28)
PC0: K60_main (K1.319), export (P_MCU_3.19)
PC3: K60_main (K1.316), Sensor (Motor_3.1), export (P_MCU_3.16)
PC4: K60_main (K1.315), export (P_MCU_3.15)
PC5: K60_main (K1.314), export (P_MCU_3.14)
PC6: main (PResLine.1 SW_Dip.16), K60_main (K1.313), export (P_MCU_3.13)
PC7: main (PResLine.2 SW_Dip.15), K60_main (K1.312), export (P_MCU_3.12)
PC8: main (PResLine.3 SW_Dip.14), K60_main (K1.311), export (P_MCU_3.11)
PC9: main (PResLine.4 SW_Dip.13), K60_main (K1.310), export (P_MCU_3.10)
PC10: main (PResLine.5 SW_Dip.12), K60_main (K1.39), export (P_MCU_3.9)
PC11: main (PResLine.6 SW_Dip.11), K60_main (K1.38), export (P_MCU_3.8)
PC12: main (PResLine.7 SW_Dip.10), K60_main (K1.37), export (P_MCU_3.7)
PC13: main (PResLine.8 SW_Dip.9), K60_main (K1.36), export (P_MCU_3.6)
PC15: K60_main (K1.34), export (P_MCU_3.4)
PC16: K60_main (K1.33), export (P_MCU_3.3)
PC17: K60_main (K1.32), export (P_MCU_3.2)
PC18: K60_main (K1.31), export (P_MCU_3.1)
PC19: main (Gyro.3), K60_main (K1.238), export (P_MCU_2.38)
PCLK: main (CAM.8), K60_main (K1.437), export (P_MCU_4.37)
PD0: main (Gyro.4), K60_main (K1.237), export (P_MCU_2.37)
PD1: K60_main (K1.236), export (P_MCU_2.36)
PD2: K60_main (K1.235), export (P_MCU_2.35)
PD3: K60_main (K1.234), export (P_MCU_2.34)
PD4: K60_main (K1.233), export (P_MCU_2.33)
PD5: K60_main (K1.232), export (P_MCU_2.32)
PD6: main (BT.3), K60_main (K1.231), export (P_MCU_2.31)
PD7: main (BT.4), K60_main (K1.230), export (P_MCU_2.30)
PD8: K60_main (K1.229), export (P_MCU_2.29)
PD9: K60_main (K1.228), export (P_MCU_2.28)
PD10: K60_main (K1.227), export (P_MCU_2.27)
PD11: K60_main (K1.226), export (P_MCU_2.26)
PD12: K60_main (K1.225), export (P_MCU_2.25)
PD13: K60_main (K1.224), export (P_MCU_2.24)
PD14: main (CAM.12), K60_main (K1.223), export (P_MCU_2.23)
PD15: K60_main (K1.222), export (P_MCU_2.22)
PE0: K60_main (K1.221), export (P_MCU_2.21)
PE1: K60_main (K1.220), export (P_MCU_2.20)
PE2: K60_main (K1.219), export (P_MCU_2.19)
PE3: K60_main (K1.218), export (P_MCU_2.18)
PE4: K60_main (K1.217), export (P_MCU_2.17)
PE7: main (LCD.5), K60_main (K1.214), export (P_MCU_2.14)
PE9: main (LCD.3), K60_main (K1.212), export (P_MCU_2.12)
PE10: main (LCD.2), K60_main (K1.211), export (P_MCU_2.11)
R_PHA: K60_main (J_R_A.2), Sensor (74HC125.2 Decoder_R.3 R_A.2)
R_PHB: K60_main (J_R_B.2), Sensor (74HC125.5 Decoder_R.4 R_B.2)